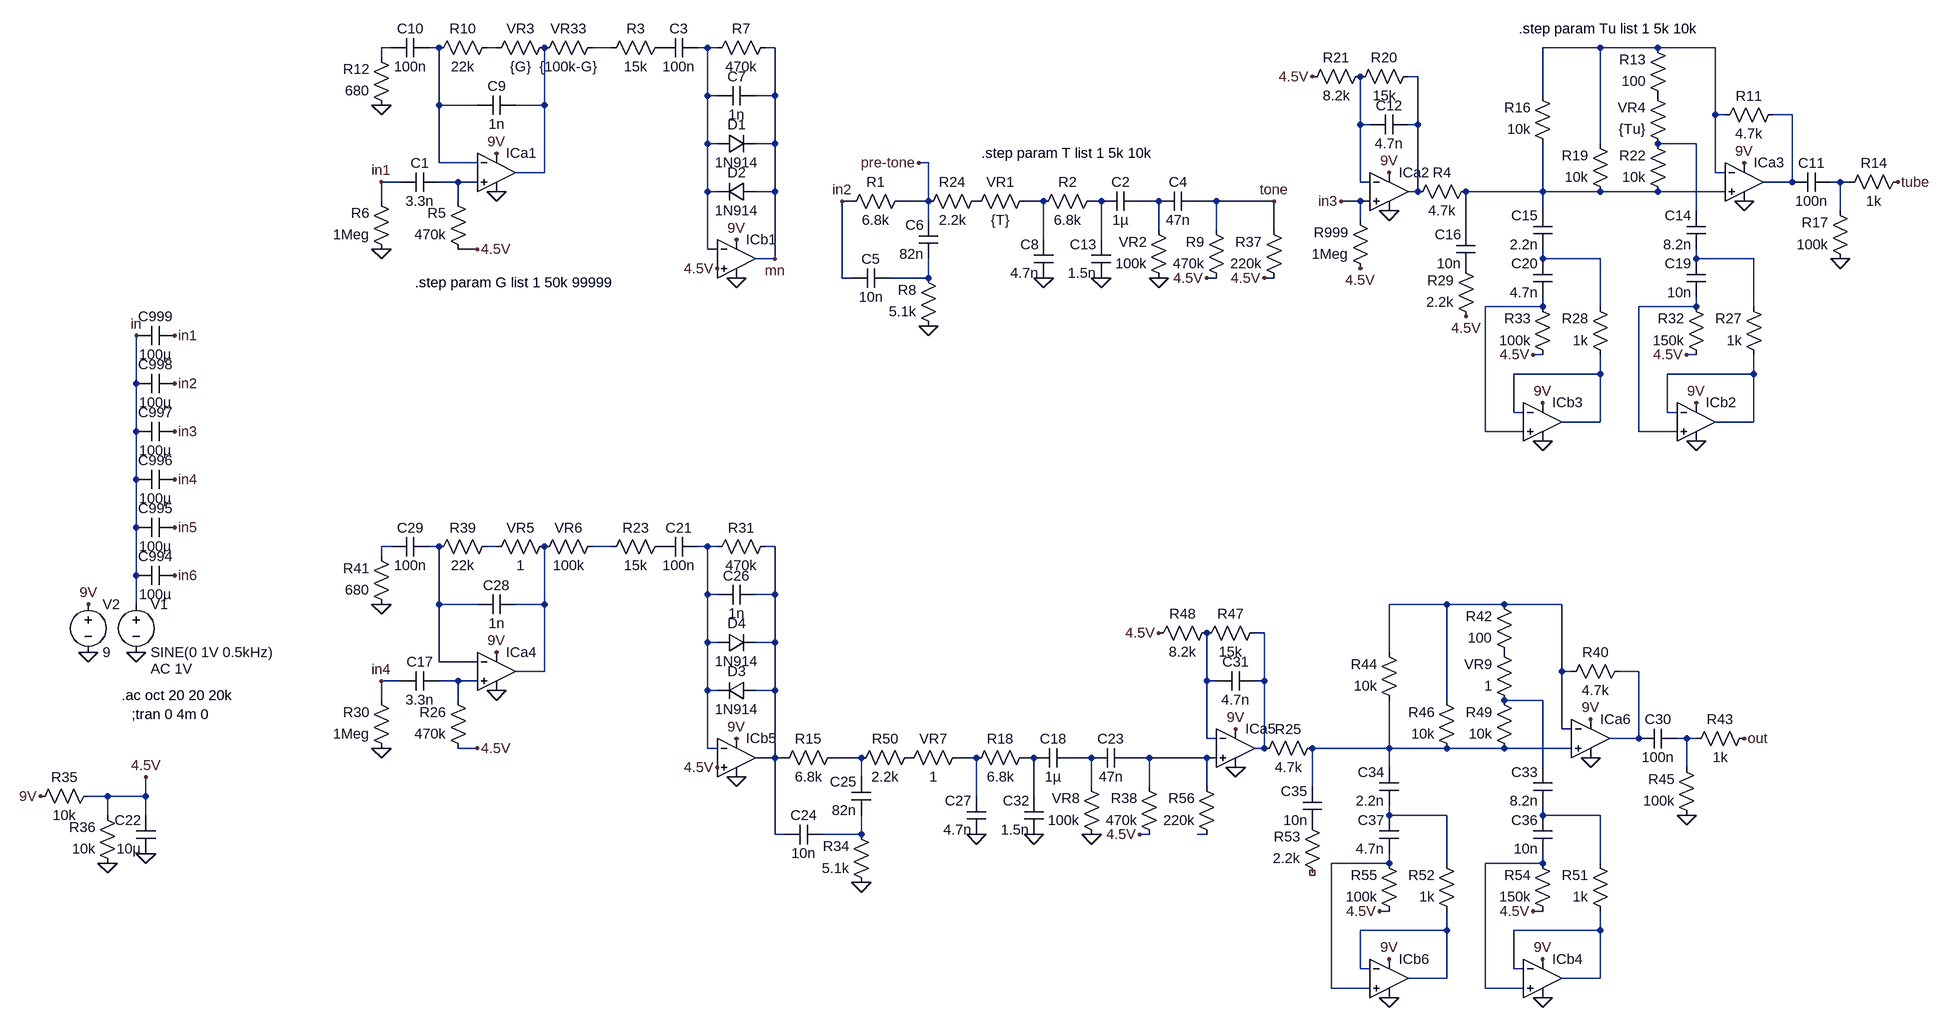
[diagram p0: schematic minerva.asc]
minerva.asc, the LTspice schematic file:
Version 4
SHEET 1 3148 3460
WIRE -1216 256 -1232 256
WIRE -1136 256 -1152 256
WIRE -1040 256 -1056 256
WIRE -848 256 -880 256
WIRE -688 256 -704 256
WIRE -672 256 -688 256
WIRE -576 256 -592 256
WIRE 800 256 704 256
WIRE 896 256 800 256
WIRE 992 256 896 256
WIRE -1232 272 -1232 256
WIRE 496 304 480 304
WIRE -688 336 -688 256
WIRE -672 336 -688 336
WIRE -576 336 -576 256
WIRE -576 336 -608 336
WIRE 704 336 704 256
WIRE -1136 352 -1136 256
WIRE -1072 352 -1136 352
WIRE -960 352 -960 256
WIRE -960 352 -1008 352
WIRE 992 368 992 256
WIRE 1008 368 992 368
WIRE 1120 368 1088 368
WIRE 400 384 400 304
WIRE 416 384 400 384
WIRE 496 384 496 304
WIRE 496 384 480 384
WIRE -688 416 -688 336
WIRE -672 416 -688 416
WIRE -576 416 -576 336
WIRE -576 416 -608 416
WIRE 800 416 800 256
WIRE 960 416 896 416
WIRE -1136 448 -1136 352
WIRE -1072 448 -1136 448
WIRE -320 448 -336 448
WIRE -960 464 -960 352
WIRE -960 464 -1008 464
WIRE 992 464 992 368
WIRE 1008 464 992 464
WIRE -1200 480 -1232 480
WIRE -1104 480 -1136 480
WIRE -1072 480 -1104 480
WIRE 400 480 400 384
WIRE 416 480 400 480
WIRE 1120 480 1120 368
WIRE 1120 480 1072 480
WIRE 1200 480 1184 480
WIRE 1216 480 1200 480
WIRE -688 496 -688 416
WIRE -672 496 -688 496
WIRE -576 496 -576 416
WIRE -576 496 -608 496
WIRE 496 496 496 384
WIRE 496 496 480 496
WIRE 704 496 704 416
WIRE 704 496 576 496
WIRE 800 496 704 496
WIRE 896 496 800 496
WIRE 1008 496 896 496
WIRE -1232 512 -1232 480
WIRE -1104 512 -1104 480
WIRE -448 512 -464 512
WIRE -320 512 -320 448
WIRE -320 512 -368 512
WIRE -128 512 -160 512
WIRE -32 512 -48 512
WIRE 64 512 32 512
WIRE 160 512 128 512
WIRE 256 512 160 512
WIRE 400 512 368 512
WIRE 416 512 400 512
WIRE 704 528 704 496
WIRE 960 528 960 416
WIRE 1200 528 1200 480
WIRE -320 544 -320 512
WIRE 400 544 400 512
WIRE 64 560 64 512
WIRE 160 560 160 512
WIRE 256 560 256 512
WIRE 576 560 576 496
WIRE -128 576 -128 512
WIRE -32 576 -32 512
WIRE -1072 592 -1104 592
WIRE -688 592 -688 496
WIRE -672 592 -688 592
WIRE -576 608 -576 496
WIRE -576 608 -608 608
WIRE 704 608 704 592
WIRE 800 608 704 608
WIRE 960 608 960 592
WIRE 1056 608 960 608
WIRE -464 640 -464 512
WIRE -448 640 -464 640
WIRE -320 640 -320 608
WIRE -320 640 -384 640
WIRE 160 640 144 640
WIRE 256 640 240 640
WIRE 704 688 704 672
WIRE 704 688 608 688
WIRE 800 688 800 608
WIRE 960 688 960 672
WIRE 960 688 864 688
WIRE 1056 688 1056 608
WIRE 704 768 688 768
WIRE 960 768 944 768
WIRE 800 800 800 768
WIRE 800 800 656 800
WIRE 1056 800 1056 768
WIRE 1056 800 912 800
WIRE -1984 816 -1984 736
WIRE 656 864 656 800
WIRE 672 864 656 864
WIRE 912 864 912 800
WIRE 928 864 912 864
WIRE 800 880 800 800
WIRE 800 880 736 880
WIRE 1056 880 1056 800
WIRE 1056 880 992 880
WIRE -1984 896 -1984 816
WIRE 608 896 608 688
WIRE 672 896 608 896
WIRE 864 896 864 688
WIRE 928 896 864 896
WIRE -1984 976 -1984 896
WIRE -1984 1056 -1984 976
WIRE -1216 1088 -1232 1088
WIRE -1136 1088 -1152 1088
WIRE -1040 1088 -1056 1088
WIRE -848 1088 -880 1088
WIRE -688 1088 -704 1088
WIRE -672 1088 -688 1088
WIRE -576 1088 -592 1088
WIRE -1232 1104 -1232 1088
WIRE -1984 1136 -1984 1056
WIRE -688 1168 -688 1088
WIRE -672 1168 -688 1168
WIRE -576 1168 -576 1088
WIRE -576 1168 -608 1168
WIRE -1984 1184 -1984 1136
WIRE -1136 1184 -1136 1088
WIRE -1072 1184 -1136 1184
WIRE -960 1184 -960 1088
WIRE -960 1184 -1008 1184
WIRE 544 1184 448 1184
WIRE 640 1184 544 1184
WIRE 736 1184 640 1184
WIRE 240 1232 224 1232
WIRE -688 1248 -688 1168
WIRE -672 1248 -688 1248
WIRE -576 1248 -576 1168
WIRE -576 1248 -608 1248
WIRE 448 1264 448 1184
WIRE -1136 1280 -1136 1184
WIRE -1072 1280 -1136 1280
WIRE -960 1296 -960 1184
WIRE -960 1296 -1008 1296
WIRE 736 1296 736 1184
WIRE 752 1296 736 1296
WIRE 864 1296 832 1296
WIRE -1200 1312 -1232 1312
WIRE -1104 1312 -1136 1312
WIRE -1072 1312 -1104 1312
WIRE 144 1312 144 1232
WIRE 160 1312 144 1312
WIRE 240 1312 240 1232
WIRE 240 1312 224 1312
WIRE -688 1328 -688 1248
WIRE -672 1328 -688 1328
WIRE -576 1328 -576 1248
WIRE -576 1328 -608 1328
WIRE -1232 1344 -1232 1312
WIRE -1104 1344 -1104 1312
WIRE 544 1344 544 1184
WIRE 704 1344 640 1344
WIRE 736 1392 736 1296
WIRE 752 1392 736 1392
WIRE 144 1408 144 1312
WIRE 160 1408 144 1408
WIRE 864 1408 864 1296
WIRE 864 1408 816 1408
WIRE 944 1408 928 1408
WIRE 960 1408 944 1408
WIRE -1072 1424 -1104 1424
WIRE -688 1424 -688 1328
WIRE -672 1424 -688 1424
WIRE 240 1424 240 1312
WIRE 240 1424 224 1424
WIRE 448 1424 448 1344
WIRE 448 1424 320 1424
WIRE 544 1424 448 1424
WIRE 640 1424 544 1424
WIRE 752 1424 640 1424
WIRE -576 1440 -576 1328
WIRE -576 1440 -608 1440
WIRE -560 1440 -576 1440
WIRE -432 1440 -480 1440
WIRE -240 1440 -272 1440
WIRE -144 1440 -160 1440
WIRE -48 1440 -80 1440
WIRE 48 1440 16 1440
WIRE 144 1440 48 1440
WIRE 160 1440 144 1440
WIRE 448 1456 448 1424
WIRE 704 1456 704 1344
WIRE 944 1456 944 1408
WIRE -432 1472 -432 1440
WIRE -48 1488 -48 1440
WIRE 48 1488 48 1440
WIRE 144 1488 144 1440
WIRE 320 1488 320 1424
WIRE -2032 1504 -2064 1504
WIRE -1968 1504 -1968 1472
WIRE -1968 1504 -2032 1504
WIRE -240 1504 -240 1440
WIRE -144 1504 -144 1440
WIRE -2032 1536 -2032 1504
WIRE -1968 1536 -1968 1504
WIRE 448 1536 448 1520
WIRE 544 1536 448 1536
WIRE 704 1536 704 1520
WIRE 800 1536 704 1536
WIRE -576 1568 -576 1440
WIRE -560 1568 -576 1568
WIRE -432 1568 -432 1536
WIRE -432 1568 -496 1568
WIRE 48 1568 32 1568
WIRE 144 1568 128 1568
WIRE 448 1616 448 1600
WIRE 448 1616 352 1616
WIRE 544 1616 544 1536
WIRE 704 1616 704 1600
WIRE 704 1616 608 1616
WIRE 800 1616 800 1536
WIRE 448 1696 432 1696
WIRE 704 1696 688 1696
WIRE 544 1728 544 1696
WIRE 544 1728 400 1728
WIRE 800 1728 800 1696
WIRE 800 1728 656 1728
WIRE 400 1792 400 1728
WIRE 416 1792 400 1792
WIRE 656 1792 656 1728
WIRE 672 1792 656 1792
WIRE 544 1808 544 1728
WIRE 544 1808 480 1808
WIRE 800 1808 800 1728
WIRE 800 1808 736 1808
WIRE 352 1824 352 1616
WIRE 416 1824 352 1824
WIRE 608 1824 608 1616
WIRE 672 1824 608 1824
FLAG -1984 1264 0
FLAG -1984 736 in
FLAG -2064 1264 0
FLAG -2064 1184 9V
FLAG -1920 736 in1
FLAG -1920 816 in2
FLAG -1920 896 in3
FLAG -1920 976 in4
FLAG -1920 1056 in5
FLAG -1920 1136 in6
FLAG -1040 432 9V
FLAG -1040 496 0
FLAG -1232 592 0
FLAG -1232 352 0
FLAG -1968 1600 0
FLAG -2032 1616 0
FLAG -2144 1504 9V
FLAG -1968 1472 4.5V
FLAG -1072 592 4.5V
FLAG -640 576 9V
FLAG -640 640 0
FLAG -672 624 4.5V
FLAG -320 720 0
FLAG -128 640 0
FLAG -32 640 0
FLAG 64 640 0
FLAG 448 528 0
FLAG 448 464 9V
FLAG 320 304 4.5V
FLAG 144 640 4.5V
FLAG 688 768 4.5V
FLAG 704 912 0
FLAG 704 848 9V
FLAG 944 768 4.5V
FLAG 960 912 0
FLAG 960 848 9V
FLAG 1040 512 0
FLAG 1040 448 9V
FLAG 1200 608 0
FLAG -1232 480 in1
FLAG 576 704 4.5V
FLAG -464 512 in2
FLAG 400 624 4.5V
FLAG -576 608 mn
FLAG 240 640 4.5V
FLAG 256 512 tone
FLAG -336 448 pre-tone
FLAG 368 512 in3
FLAG 1296 480 tube
FLAG -1040 1264 9V
FLAG -1040 1328 0
FLAG -1232 1424 0
FLAG -1232 1184 0
FLAG -1072 1424 4.5V
FLAG -640 1408 9V
FLAG -640 1472 0
FLAG -672 1456 4.5V
FLAG -432 1648 0
FLAG -240 1568 0
FLAG -144 1568 0
FLAG -48 1568 0
FLAG 192 1456 0
FLAG 192 1392 9V
FLAG 64 1232 4.5V
FLAG 32 1568 4.5V
FLAG 432 1696 4.5V
FLAG 448 1840 0
FLAG 448 1776 9V
FLAG 688 1696 4.5V
FLAG 704 1840 0
FLAG 704 1776 9V
FLAG 784 1440 0
FLAG 784 1376 9V
FLAG 944 1536 0
FLAG -1232 1312 in4
FLAG 1040 1408 out
SYMBOL voltage -1984 1168 R0
WINDOW 123 24 124 Left 2
WINDOW 39 0 0 Left 2
SYMATTR Value2 AC 1V
SYMATTR InstName V1
SYMATTR Value SINE(0 1V 0.5kHz)
SYMBOL voltage -2064 1168 R0
WINDOW 123 0 0 Left 0
WINDOW 39 0 0 Left 0
SYMATTR InstName V2
SYMATTR Value 9
SYMBOL Opamps\\UniversalOpamp2 -1040 464 R0
SYMATTR InstName ICa1
SYMBOL Opamps\\UniversalOpamp2 448 496 R0
SYMATTR InstName ICa2
SYMBOL Opamps\\UniversalOpamp2 960 880 R0
SYMATTR InstName ICb2
SYMBOL Opamps\\UniversalOpamp2 1040 480 R0
SYMATTR InstName ICa3
SYMBOL Opamps\\UniversalOpamp2 -640 608 R0
SYMATTR InstName ICb1
SYMBOL Opamps\\UniversalOpamp2 704 880 R0
SYMATTR InstName ICb3
SYMBOL cap -1920 800 R90
WINDOW 0 0 32 VBottom 2
WINDOW 3 32 32 VTop 2
SYMATTR InstName C998
SYMATTR Value 100µ
SYMBOL cap -1920 880 R90
WINDOW 0 0 32 VBottom 2
WINDOW 3 32 32 VTop 2
SYMATTR InstName C997
SYMATTR Value 100µ
SYMBOL cap -1920 960 R90
WINDOW 0 0 32 VBottom 2
WINDOW 3 32 32 VTop 2
SYMATTR InstName C996
SYMATTR Value 100µ
SYMBOL cap -1920 720 R90
WINDOW 0 0 32 VBottom 2
WINDOW 3 32 32 VTop 2
SYMATTR InstName C999
SYMATTR Value 100µ
SYMBOL cap -1920 1040 R90
WINDOW 0 0 32 VBottom 2
WINDOW 3 32 32 VTop 2
SYMATTR InstName C995
SYMATTR Value 100µ
SYMBOL cap -1920 1120 R90
WINDOW 0 0 32 VBottom 2
WINDOW 3 32 32 VTop 2
SYMATTR InstName C994
SYMATTR Value 100µ
SYMBOL res -352 496 R90
WINDOW 0 0 56 VBottom 2
WINDOW 3 32 56 VTop 2
SYMATTR InstName R1
SYMATTR Value 6.8k
SYMBOL cap -1136 464 R90
WINDOW 0 0 32 VBottom 2
WINDOW 3 32 32 VTop 2
SYMATTR InstName C1
SYMATTR Value 3.3n
SYMBOL cap 32 496 R90
WINDOW 0 0 32 VBottom 2
WINDOW 3 32 32 VTop 2
SYMATTR InstName C2
SYMATTR Value 1µ
SYMBOL cap -704 240 R90
WINDOW 0 0 32 VBottom 2
WINDOW 3 32 32 VTop 2
SYMATTR InstName C3
SYMATTR Value 100n
SYMBOL cap 128 496 R90
WINDOW 0 0 32 VBottom 2
WINDOW 3 32 32 VTop 2
SYMATTR InstName C4
SYMATTR Value 47n
SYMBOL cap -384 624 R90
WINDOW 0 0 32 VBottom 2
WINDOW 3 32 32 VTop 2
SYMATTR InstName C5
SYMATTR Value 10n
SYMBOL cap -304 608 R180
WINDOW 0 24 56 Left 2
WINDOW 3 24 8 Left 2
SYMATTR InstName C6
SYMATTR Value 82n
SYMBOL cap -608 320 R90
WINDOW 0 0 32 VBottom 2
WINDOW 3 32 32 VTop 2
SYMATTR InstName C7
SYMATTR Value 1n
SYMBOL cap -112 640 R180
WINDOW 0 24 56 Left 2
WINDOW 3 24 8 Left 2
SYMATTR InstName C8
SYMATTR Value 4.7n
SYMBOL cap -1008 336 R90
WINDOW 0 0 32 VBottom 2
WINDOW 3 32 32 VTop 2
SYMATTR InstName C9
SYMATTR Value 1n
SYMBOL cap -1152 240 R90
WINDOW 0 0 32 VBottom 2
WINDOW 3 32 32 VTop 2
SYMATTR InstName C10
SYMATTR Value 100n
SYMBOL cap 1120 496 R270
WINDOW 0 32 32 VTop 2
WINDOW 3 0 32 VBottom 2
SYMATTR InstName C11
SYMATTR Value 100n
SYMBOL cap 480 368 R90
WINDOW 0 0 32 VBottom 2
WINDOW 3 32 32 VTop 2
SYMATTR InstName C12
SYMATTR Value 4.7n
SYMBOL cap -16 640 R180
WINDOW 0 24 56 Left 2
WINDOW 3 24 8 Left 2
SYMATTR InstName C13
SYMATTR Value 1.5n
SYMBOL cap 976 592 R180
WINDOW 0 24 56 Left 2
WINDOW 3 24 8 Left 2
SYMATTR InstName C14
SYMATTR Value 8.2n
SYMBOL cap 720 592 R180
WINDOW 0 24 56 Left 2
WINDOW 3 24 8 Left 2
SYMATTR InstName C15
SYMATTR Value 2.2n
SYMBOL cap 592 624 R180
WINDOW 0 24 56 Left 2
WINDOW 3 24 8 Left 2
SYMATTR InstName C16
SYMATTR Value 10n
SYMBOL cap 976 672 R180
WINDOW 0 24 56 Left 2
WINDOW 3 24 8 Left 2
SYMATTR InstName C19
SYMATTR Value 10n
SYMBOL cap 720 672 R180
WINDOW 0 24 56 Left 2
WINDOW 3 24 8 Left 2
SYMATTR InstName C20
SYMATTR Value 4.7n
SYMBOL cap -1952 1600 R180
WINDOW 0 24 56 Left 2
WINDOW 3 24 8 Left 2
SYMATTR InstName C22
SYMATTR Value 10µ
SYMBOL res -32 496 R90
WINDOW 0 0 56 VBottom 2
WINDOW 3 32 56 VTop 2
SYMATTR InstName R2
SYMATTR Value 6.8k
SYMBOL res -752 240 R90
WINDOW 0 0 56 VBottom 2
WINDOW 3 32 56 VTop 2
SYMATTR InstName R3
SYMATTR Value 15k
SYMBOL res 592 480 R90
WINDOW 0 0 56 VBottom 2
WINDOW 3 32 56 VTop 2
SYMATTR InstName R4
SYMATTR Value 4.7k
SYMBOL res -1088 608 R180
WINDOW 0 36 76 Left 2
WINDOW 3 36 40 Left 2
SYMATTR InstName R5
SYMATTR Value 470k
SYMBOL res -1216 608 R180
WINDOW 0 36 76 Left 2
WINDOW 3 36 40 Left 2
SYMATTR InstName R6
SYMATTR Value 1Meg
SYMBOL res -576 240 R90
WINDOW 0 0 56 VBottom 2
WINDOW 3 32 56 VTop 2
SYMATTR InstName R7
SYMATTR Value 470k
SYMBOL res -304 736 R180
WINDOW 0 36 76 Left 2
WINDOW 3 36 40 Left 2
SYMATTR InstName R8
SYMATTR Value 5.1k
SYMBOL res 176 656 R180
WINDOW 0 36 76 Left 2
WINDOW 3 36 40 Left 2
SYMATTR InstName R9
SYMATTR Value 470k
SYMBOL res -1040 240 R90
WINDOW 0 0 56 VBottom 2
WINDOW 3 32 56 VTop 2
SYMATTR InstName R10
SYMATTR Value 22k
SYMBOL res 1104 352 R90
WINDOW 0 0 56 VBottom 2
WINDOW 3 32 56 VTop 2
SYMATTR InstName R11
SYMATTR Value 4.7k
SYMBOL res -1216 368 R180
WINDOW 0 36 76 Left 2
WINDOW 3 36 40 Left 2
SYMATTR InstName R12
SYMATTR Value 680
SYMBOL res 912 352 R180
WINDOW 0 36 76 Left 2
WINDOW 3 36 40 Left 2
SYMATTR InstName R13
SYMATTR Value 100
SYMBOL res 1312 464 R90
WINDOW 0 0 56 VBottom 2
WINDOW 3 32 56 VTop 2
SYMATTR InstName R14
SYMATTR Value 1k
SYMBOL res 720 432 R180
WINDOW 0 36 76 Left 2
WINDOW 3 36 40 Left 2
SYMATTR InstName R16
SYMATTR Value 10k
SYMBOL res 1216 624 R180
WINDOW 0 36 76 Left 2
WINDOW 3 36 40 Left 2
SYMATTR InstName R17
SYMATTR Value 100k
SYMBOL res 816 512 R180
WINDOW 0 36 76 Left 2
WINDOW 3 36 40 Left 2
SYMATTR InstName R19
SYMATTR Value 10k
SYMBOL res 496 288 R90
WINDOW 0 0 56 VBottom 2
WINDOW 3 32 56 VTop 2
SYMATTR InstName R20
SYMATTR Value 15k
SYMBOL res 416 288 R90
WINDOW 0 0 56 VBottom 2
WINDOW 3 32 56 VTop 2
SYMATTR InstName R21
SYMATTR Value 8.2k
SYMBOL res 912 512 R180
WINDOW 0 36 76 Left 2
WINDOW 3 36 40 Left 2
SYMATTR InstName R22
SYMATTR Value 10k
SYMBOL res -224 496 R90
WINDOW 0 0 56 VBottom 2
WINDOW 3 32 56 VTop 2
SYMATTR InstName R24
SYMATTR Value 2.2k
SYMBOL res 1072 784 R180
WINDOW 0 36 76 Left 2
WINDOW 3 36 40 Left 2
SYMATTR InstName R27
SYMATTR Value 1k
SYMBOL res 816 784 R180
WINDOW 0 36 76 Left 2
WINDOW 3 36 40 Left 2
SYMATTR InstName R28
SYMATTR Value 1k
SYMBOL res 592 720 R180
WINDOW 0 36 76 Left 2
WINDOW 3 36 40 Left 2
SYMATTR InstName R29
SYMATTR Value 2.2k
SYMBOL res 976 784 R180
WINDOW 0 36 76 Left 2
WINDOW 3 36 40 Left 2
SYMATTR InstName R32
SYMATTR Value 150k
SYMBOL diode -608 480 R90
WINDOW 0 0 32 VBottom 2
WINDOW 3 32 32 VTop 2
SYMATTR InstName D2
SYMATTR Value 1N914
SYMBOL diode -672 400 M90
WINDOW 0 0 32 VBottom 2
WINDOW 3 32 32 VTop 2
SYMATTR InstName D1
SYMATTR Value 1N914
SYMBOL res 720 784 R180
WINDOW 0 36 76 Left 2
WINDOW 3 36 40 Left 2
SYMATTR InstName R33
SYMATTR Value 100k
SYMBOL res -2048 1488 R90
WINDOW 0 0 56 VBottom 2
WINDOW 3 32 56 VTop 2
SYMATTR InstName R35
SYMATTR Value 10k
SYMBOL res -2016 1632 R180
WINDOW 0 36 76 Left 2
WINDOW 3 36 40 Left 2
SYMATTR InstName R36
SYMATTR Value 10k
SYMBOL res 272 656 R180
WINDOW 0 36 76 Left 2
WINDOW 3 36 40 Left 2
SYMATTR InstName R37
SYMATTR Value 220k
SYMBOL res -944 240 R90
WINDOW 0 0 56 VBottom 2
WINDOW 3 32 56 VTop 2
SYMATTR InstName VR3
SYMATTR Value {G}
SYMBOL res -864 240 R90
WINDOW 0 0 56 VBottom 2
WINDOW 3 32 56 VTop 2
SYMATTR InstName VR33
SYMATTR Value {100k-G}
SYMBOL res -144 496 R90
WINDOW 0 0 56 VBottom 2
WINDOW 3 32 56 VTop 2
SYMATTR InstName VR1
SYMATTR Value {T}
SYMBOL res 80 656 R180
WINDOW 0 36 76 Left 2
WINDOW 3 36 40 Left 2
SYMATTR InstName VR2
SYMATTR Value 100k
SYMBOL res 912 432 R180
WINDOW 0 36 76 Left 2
WINDOW 3 36 40 Left 2
SYMATTR InstName VR4
SYMATTR Value {Tu}
SYMBOL res 416 640 R180
WINDOW 0 36 76 Left 2
WINDOW 3 36 40 Left 2
SYMATTR InstName R999
SYMATTR Value 1Meg
SYMBOL Opamps\\UniversalOpamp2 -1040 1296 R0
SYMATTR InstName ICa4
SYMBOL Opamps\\UniversalOpamp2 192 1424 R0
SYMATTR InstName ICa5
SYMBOL Opamps\\UniversalOpamp2 704 1808 R0
SYMATTR InstName ICb4
SYMBOL Opamps\\UniversalOpamp2 784 1408 R0
SYMATTR InstName ICa6
SYMBOL Opamps\\UniversalOpamp2 -640 1440 R0
SYMATTR InstName ICb5
SYMBOL Opamps\\UniversalOpamp2 448 1808 R0
SYMATTR InstName ICb6
SYMBOL res -464 1424 R90
WINDOW 0 0 56 VBottom 2
WINDOW 3 32 56 VTop 2
SYMATTR InstName R15
SYMATTR Value 6.8k
SYMBOL cap -1136 1296 R90
WINDOW 0 0 32 VBottom 2
WINDOW 3 32 32 VTop 2
SYMATTR InstName C17
SYMATTR Value 3.3n
SYMBOL cap -80 1424 R90
WINDOW 0 0 32 VBottom 2
WINDOW 3 32 32 VTop 2
SYMATTR InstName C18
SYMATTR Value 1µ
SYMBOL cap -704 1072 R90
WINDOW 0 0 32 VBottom 2
WINDOW 3 32 32 VTop 2
SYMATTR InstName C21
SYMATTR Value 100n
SYMBOL cap 16 1424 R90
WINDOW 0 0 32 VBottom 2
WINDOW 3 32 32 VTop 2
SYMATTR InstName C23
SYMATTR Value 47n
SYMBOL cap -496 1552 R90
WINDOW 0 0 32 VBottom 2
WINDOW 3 32 32 VTop 2
SYMATTR InstName C24
SYMATTR Value 10n
SYMBOL cap -416 1536 R180
WINDOW 0 24 56 Left 2
WINDOW 3 24 8 Left 2
SYMATTR InstName C25
SYMATTR Value 82n
SYMBOL cap -608 1152 R90
WINDOW 0 0 32 VBottom 2
WINDOW 3 32 32 VTop 2
SYMATTR InstName C26
SYMATTR Value 1n
SYMBOL cap -224 1568 R180
WINDOW 0 24 56 Left 2
WINDOW 3 24 8 Left 2
SYMATTR InstName C27
SYMATTR Value 4.7n
SYMBOL cap -1008 1168 R90
WINDOW 0 0 32 VBottom 2
WINDOW 3 32 32 VTop 2
SYMATTR InstName C28
SYMATTR Value 1n
SYMBOL cap -1152 1072 R90
WINDOW 0 0 32 VBottom 2
WINDOW 3 32 32 VTop 2
SYMATTR InstName C29
SYMATTR Value 100n
SYMBOL cap 864 1424 R270
WINDOW 0 32 32 VTop 2
WINDOW 3 0 32 VBottom 2
SYMATTR InstName C30
SYMATTR Value 100n
SYMBOL cap 224 1296 R90
WINDOW 0 0 32 VBottom 2
WINDOW 3 32 32 VTop 2
SYMATTR InstName C31
SYMATTR Value 4.7n
SYMBOL cap -128 1568 R180
WINDOW 0 24 56 Left 2
WINDOW 3 24 8 Left 2
SYMATTR InstName C32
SYMATTR Value 1.5n
SYMBOL cap 720 1520 R180
WINDOW 0 24 56 Left 2
WINDOW 3 24 8 Left 2
SYMATTR InstName C33
SYMATTR Value 8.2n
SYMBOL cap 464 1520 R180
WINDOW 0 24 56 Left 2
WINDOW 3 24 8 Left 2
SYMATTR InstName C34
SYMATTR Value 2.2n
SYMBOL cap 336 1552 R180
WINDOW 0 24 56 Left 2
WINDOW 3 24 8 Left 2
SYMATTR InstName C35
SYMATTR Value 10n
SYMBOL cap 720 1600 R180
WINDOW 0 24 56 Left 2
WINDOW 3 24 8 Left 2
SYMATTR InstName C36
SYMATTR Value 10n
SYMBOL cap 464 1600 R180
WINDOW 0 24 56 Left 2
WINDOW 3 24 8 Left 2
SYMATTR InstName C37
SYMATTR Value 4.7n
SYMBOL res -144 1424 R90
WINDOW 0 0 56 VBottom 2
WINDOW 3 32 56 VTop 2
SYMATTR InstName R18
SYMATTR Value 6.8k
SYMBOL res -752 1072 R90
WINDOW 0 0 56 VBottom 2
WINDOW 3 32 56 VTop 2
SYMATTR InstName R23
SYMATTR Value 15k
SYMBOL res 336 1408 R90
WINDOW 0 0 56 VBottom 2
WINDOW 3 32 56 VTop 2
SYMATTR InstName R25
SYMATTR Value 4.7k
SYMBOL res -1088 1440 R180
WINDOW 0 36 76 Left 2
WINDOW 3 36 40 Left 2
SYMATTR InstName R26
SYMATTR Value 470k
SYMBOL res -1216 1440 R180
WINDOW 0 36 76 Left 2
WINDOW 3 36 40 Left 2
SYMATTR InstName R30
SYMATTR Value 1Meg
SYMBOL res -576 1072 R90
WINDOW 0 0 56 VBottom 2
WINDOW 3 32 56 VTop 2
SYMATTR InstName R31
SYMATTR Value 470k
SYMBOL res -416 1664 R180
WINDOW 0 36 76 Left 2
WINDOW 3 36 40 Left 2
SYMATTR InstName R34
SYMATTR Value 5.1k
SYMBOL res 64 1584 R180
WINDOW 0 36 76 Left 2
WINDOW 3 36 40 Left 2
SYMATTR InstName R38
SYMATTR Value 470k
SYMBOL res -1040 1072 R90
WINDOW 0 0 56 VBottom 2
WINDOW 3 32 56 VTop 2
SYMATTR InstName R39
SYMATTR Value 22k
SYMBOL res 848 1280 R90
WINDOW 0 0 56 VBottom 2
WINDOW 3 32 56 VTop 2
SYMATTR InstName R40
SYMATTR Value 4.7k
SYMBOL res -1216 1200 R180
WINDOW 0 36 76 Left 2
WINDOW 3 36 40 Left 2
SYMATTR InstName R41
SYMATTR Value 680
SYMBOL res 656 1280 R180
WINDOW 0 36 76 Left 2
WINDOW 3 36 40 Left 2
SYMATTR InstName R42
SYMATTR Value 100
SYMBOL res 1056 1392 R90
WINDOW 0 0 56 VBottom 2
WINDOW 3 32 56 VTop 2
SYMATTR InstName R43
SYMATTR Value 1k
SYMBOL res 464 1360 R180
WINDOW 0 36 76 Left 2
WINDOW 3 36 40 Left 2
SYMATTR InstName R44
SYMATTR Value 10k
SYMBOL res 960 1552 R180
WINDOW 0 36 76 Left 2
WINDOW 3 36 40 Left 2
SYMATTR InstName R45
SYMATTR Value 100k
SYMBOL res 560 1440 R180
WINDOW 0 36 76 Left 2
WINDOW 3 36 40 Left 2
SYMATTR InstName R46
SYMATTR Value 10k
SYMBOL res 240 1216 R90
WINDOW 0 0 56 VBottom 2
WINDOW 3 32 56 VTop 2
SYMATTR InstName R47
SYMATTR Value 15k
SYMBOL res 160 1216 R90
WINDOW 0 0 56 VBottom 2
WINDOW 3 32 56 VTop 2
SYMATTR InstName R48
SYMATTR Value 8.2k
SYMBOL res 656 1440 R180
WINDOW 0 36 76 Left 2
WINDOW 3 36 40 Left 2
SYMATTR InstName R49
SYMATTR Value 10k
SYMBOL res -336 1424 R90
WINDOW 0 0 56 VBottom 2
WINDOW 3 32 56 VTop 2
SYMATTR InstName R50
SYMATTR Value 2.2k
SYMBOL res 816 1712 R180
WINDOW 0 36 76 Left 2
WINDOW 3 36 40 Left 2
SYMATTR InstName R51
SYMATTR Value 1k
SYMBOL res 560 1712 R180
WINDOW 0 36 76 Left 2
WINDOW 3 36 40 Left 2
SYMATTR InstName R52
SYMATTR Value 1k
SYMBOL res 336 1648 R180
WINDOW 0 36 76 Left 2
WINDOW 3 36 40 Left 2
SYMATTR InstName R53
SYMATTR Value 2.2k
SYMBOL res 720 1712 R180
WINDOW 0 36 76 Left 2
WINDOW 3 36 40 Left 2
SYMATTR InstName R54
SYMATTR Value 150k
SYMBOL diode -608 1312 R90
WINDOW 0 0 32 VBottom 2
WINDOW 3 32 32 VTop 2
SYMATTR InstName D3
SYMATTR Value 1N914
SYMBOL diode -672 1232 M90
WINDOW 0 0 32 VBottom 2
WINDOW 3 32 32 VTop 2
SYMATTR InstName D4
SYMATTR Value 1N914
SYMBOL res 464 1712 R180
WINDOW 0 36 76 Left 2
WINDOW 3 36 40 Left 2
SYMATTR InstName R55
SYMATTR Value 100k
SYMBOL res 160 1584 R180
WINDOW 0 36 76 Left 2
WINDOW 3 36 40 Left 2
SYMATTR InstName R56
SYMATTR Value 220k
SYMBOL res -944 1072 R90
WINDOW 0 0 56 VBottom 2
WINDOW 3 32 56 VTop 2
SYMATTR InstName VR5
SYMATTR Value 1
SYMBOL res -864 1072 R90
WINDOW 0 0 56 VBottom 2
WINDOW 3 32 56 VTop 2
SYMATTR InstName VR6
SYMATTR Value 100k
SYMBOL res -256 1424 R90
WINDOW 0 0 56 VBottom 2
WINDOW 3 32 56 VTop 2
SYMATTR InstName VR7
SYMATTR Value 1
SYMBOL res -32 1584 R180
WINDOW 0 36 76 Left 2
WINDOW 3 36 40 Left 2
SYMATTR InstName VR8
SYMATTR Value 100k
SYMBOL res 656 1360 R180
WINDOW 0 36 76 Left 2
WINDOW 3 36 40 Left 2
SYMATTR InstName VR9
SYMATTR Value 1
TEXT -2008 1336 Left 2 !.ac oct 20 20 20k
TEXT -1992 1368 Left 2 !;tran 0 4m 0
TEXT -232 432 Left 2 !.step param T list 1 5k 10k
TEXT -1176 648 Left 2 !.step param G list 1 50k 99999
TEXT 664 224 Left 2 !.step param Tu list 1 5k 10k

The netlist it stands for:
* minerva.asc
V1 in 0 SINE(0 1V 0.5kHz) AC 1V
V2 9V 0 9
XICa1 N012 N002 9V 0 N008 level.2 Avol=1Meg GBW=10Meg Slew=10Meg ilimit=25m rail=0 Vos=0 phimargin=45 en=0 enk=0 in=0 ink=0 Rin=500Meg  ; pins IN+ IN- V+ V- OUT
XICa2 in3 N010 9V 0 N007 level.2 Avol=1Meg GBW=10Meg Slew=10Meg ilimit=25m rail=0 Vos=0 phimargin=45 en=0 enk=0 in=0 ink=0 Rin=500Meg  ; pins IN+ IN- V+ V- OUT
XICb2 N022 N024 9V 0 N024 level.2 Avol=1Meg GBW=10Meg Slew=10Meg ilimit=25m rail=0 Vos=0 phimargin=45 en=0 enk=0 in=0 ink=0 Rin=500Meg  ; pins IN+ IN- V+ V- OUT
XICa3 N014 N006 9V 0 N009 level.2 Avol=1Meg GBW=10Meg Slew=10Meg ilimit=25m rail=0 Vos=0 phimargin=45 en=0 enk=0 in=0 ink=0 Rin=500Meg  ; pins IN+ IN- V+ V- OUT
XICb1 4.5V N005 9V 0 mn level.2 Avol=1Meg GBW=10Meg Slew=10Meg ilimit=25m rail=0 Vos=0 phimargin=45 en=0 enk=0 in=0 ink=0 Rin=500Meg  ; pins IN+ IN- V+ V- OUT
XICb3 N021 N023 9V 0 N023 level.2 Avol=1Meg GBW=10Meg Slew=10Meg ilimit=25m rail=0 Vos=0 phimargin=45 en=0 enk=0 in=0 ink=0 Rin=500Meg  ; pins IN+ IN- V+ V- OUT
C998 in2 in 100µ
C997 in3 in 100µ
C996 in4 in 100µ
C999 in1 in 100µ
C995 in5 in 100µ
C994 in6 in 100µ
R1 pre-tone in2 6.8k
C1 N012 in1 3.3n
C2 N017 N016 1µ
C3 N005 P001 100n
C4 tone N017 47n
C5 N020 in2 10n
C6 N020 pre-tone 82n
C7 mn N005 1n
C8 0 N015 4.7n
C9 N008 N002 1n
C10 N002 N001 100n
C11 N009 N013 100n
C12 N007 N010 4.7n
C13 0 N016 1.5n
C14 N019 N011 8.2n
C15 N018 N014 2.2n
C16 P002 N014 10n
C19 N022 N019 10n
C20 N021 N018 4.7n
C22 0 4.5V 10µ
R2 N016 N015 6.8k
R3 P001 N004 15k
R4 N014 N007 4.7k
R5 4.5V N012 470k
R6 0 in1 1Meg
R7 mn N005 470k
R8 0 N020 5.1k
R9 4.5V tone 470k
R10 N003 N002 22k
R11 N009 N006 4.7k
R12 0 N001 680
R13 P003 N006 100
R14 tube N013 1k
R16 N014 N006 10k
R17 0 N013 100k
R19 N014 N006 10k
R20 N007 N010 15k
R21 N010 4.5V 8.2k
R22 N014 N011 10k
R24 P004 pre-tone 2.2k
R27 N024 N019 1k
R28 N023 N018 1k
R29 4.5V P002 2.2k
R32 4.5V N022 150k
D2 mn N005 1N914
D1 N005 mn 1N914
R33 4.5V N021 100k
R35 4.5V 9V 10k
R36 0 4.5V 10k
R37 4.5V tone 220k
R§VR3 N008 N003 {G}
R§VR33 N004 N008 {100k-G}
R§VR1 N015 P004 {T}
R§VR2 0 N017 100k
R§VR4 N011 P003 {Tu}
R999 4.5V in3 1Meg
XICa4 N035 N026 9V 0 N031 level.2 Avol=1Meg GBW=10Meg Slew=10Meg ilimit=25m rail=0 Vos=0 phimargin=45 en=0 enk=0 in=0 ink=0 Rin=500Meg  ; pins IN+ IN- V+ V- OUT
XICa5 N044 N036 9V 0 N033 level.2 Avol=1Meg GBW=10Meg Slew=10Meg ilimit=25m rail=0 Vos=0 phimargin=45 en=0 enk=0 in=0 ink=0 Rin=500Meg  ; pins IN+ IN- V+ V- OUT
XICb4 N050 N052 9V 0 N052 level.2 Avol=1Meg GBW=10Meg Slew=10Meg ilimit=25m rail=0 Vos=0 phimargin=45 en=0 enk=0 in=0 ink=0 Rin=500Meg  ; pins IN+ IN- V+ V- OUT
XICa6 N039 N032 9V 0 N034 level.2 Avol=1Meg GBW=10Meg Slew=10Meg ilimit=25m rail=0 Vos=0 phimargin=45 en=0 enk=0 in=0 ink=0 Rin=500Meg  ; pins IN+ IN- V+ V- OUT
XICb5 4.5V N029 9V 0 N030 level.2 Avol=1Meg GBW=10Meg Slew=10Meg ilimit=25m rail=0 Vos=0 phimargin=45 en=0 enk=0 in=0 ink=0 Rin=500Meg  ; pins IN+ IN- V+ V- OUT
XICb6 N049 N051 9V 0 N051 level.2 Avol=1Meg GBW=10Meg Slew=10Meg ilimit=25m rail=0 Vos=0 phimargin=45 en=0 enk=0 in=0 ink=0 Rin=500Meg  ; pins IN+ IN- V+ V- OUT
R15 N040 N030 6.8k
C17 N035 in4 3.3n
C18 N043 N042 1µ
C21 N029 P005 100n
C23 N044 N043 47n
C24 N047 N030 10n
C25 N047 N040 82n
C26 N030 N029 1n
C27 0 N041 4.7n
C28 N031 N026 1n
C29 N026 N025 100n
C30 N034 N038 100n
C31 N033 N036 4.7n
C32 0 N042 1.5n
C33 N046 N037 8.2n
C34 N045 N039 2.2n
C35 P006 N039 10n
C36 N050 N046 10n
C37 N049 N045 4.7n
R18 N042 N041 6.8k
R23 P005 N028 15k
R25 N039 N033 4.7k
R26 4.5V N035 470k
R30 0 in4 1Meg
R31 N030 N029 470k
R34 0 N047 5.1k
R38 4.5V N044 470k
R39 N027 N026 22k
R40 N034 N032 4.7k
R41 0 N025 680
R42 P007 N032 100
R43 out N038 1k
R44 N039 N032 10k
R45 0 N038 100k
R46 N039 N032 10k
R47 N033 N036 15k
R48 N036 4.5V 8.2k
R49 N039 N037 10k
R50 P008 N040 2.2k
R51 N052 N046 1k
R52 N051 N045 1k
R53 NC_01 P006 2.2k
R54 4.5V N050 150k
D3 N030 N029 1N914
D4 N029 N030 1N914
R55 4.5V N049 100k
R56 N048 N044 220k
R§VR5 N031 N027 1
R§VR6 N028 N031 100k
R§VR7 N041 P008 1
R§VR8 0 N043 100k
R§VR9 N037 P007 1
.model D D
.lib standard.dio
.ac oct 20 20 20k
;tran 0 4m 0
.step param T list 1 5k 10k
.step param G list 1 50k 99999
.step param Tu list 1 5k 10k
.lib UniversalOpamps2.sub
.backanno
.end